# EAGLE design pidshield-mk-3.1 (EAGLE 6.5.0)
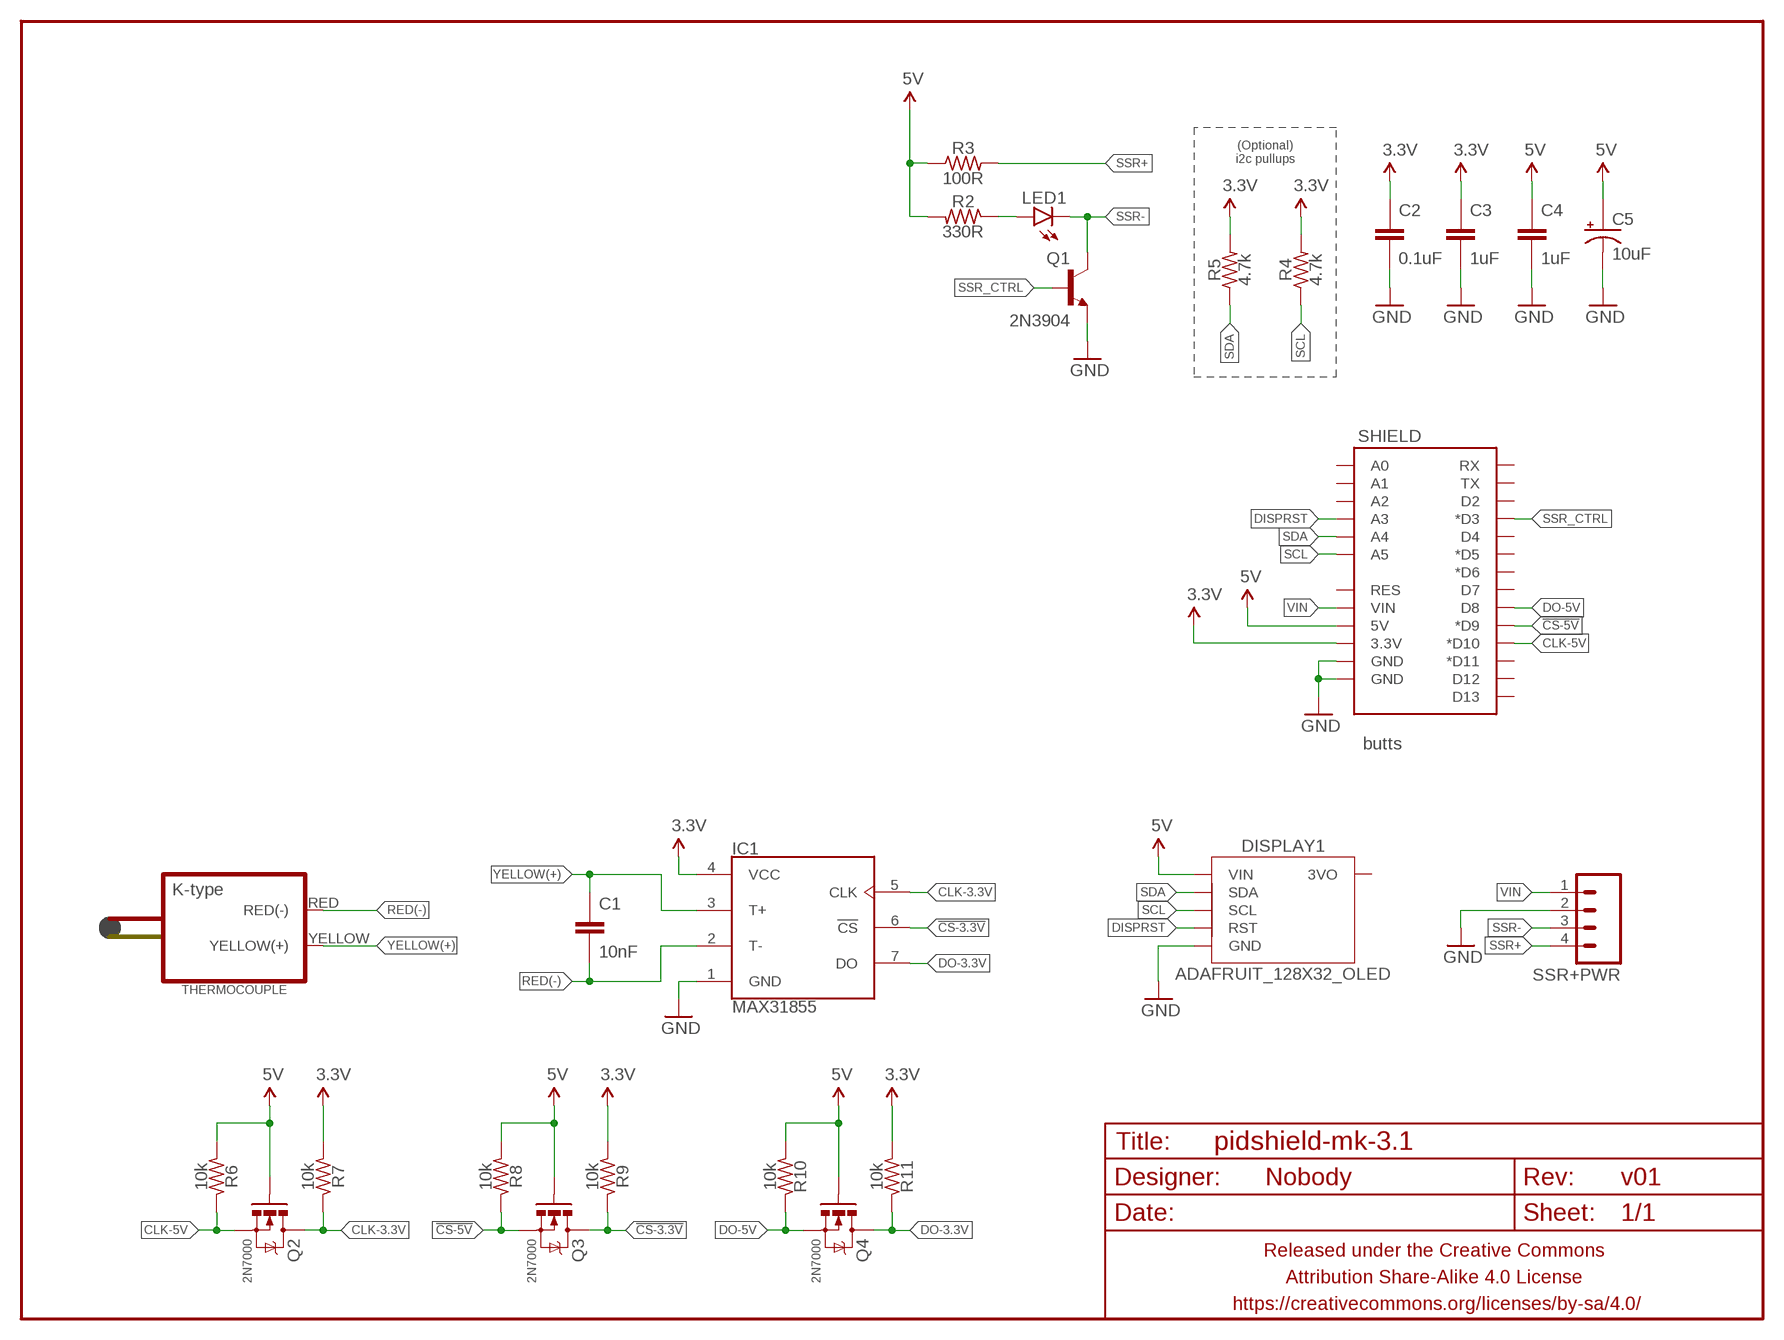
[diagram p0: schematic, sheet 1]

## Parts
C1  10nF  CAPACITOR-CERAMICC0805  [C0805]
C2  0.1uF  CAPACITOR-CERAMIC025-024X044  [C025-024X044]
C3  1uF  CAPACITOR-CERAMIC025-024X044  [C025-024X044]
C4  1uF  CAPACITOR-CERAMIC025-024X044  [C025-024X044]
C5  10uF  CAPACITOR-POLARIZEDE2.5-6  [E2,5-6]
DISPLAY1  ADAFRUIT_128X32_OLED  ADAFRUIT_128X32_OLED_I2CNOTITLE  [ADAFRUIT_128X32_OLED_I2C_CLOSER_NOTITLE]
FRAME1  FRAME-LETTERNO_PACKAGE  [DUMMY]
IC1  MAX31855  MAX31855SOIC  [SOIC127P600X175-8N]
LED1  LED3MM-LESS  [LED3MM-LESSSILK]
Q1  2N3904  TRANSISTOR_NPNTO-92-AMMO-EBC  [TO-92-AMMO]
Q2  2N7000  MOSFET-NCHANNEL2N7000-AMMO  [TO-92-AMMO]
Q3  2N7000  MOSFET-NCHANNEL2N7000-AMMO  [TO-92-AMMO]
Q4  2N7000  MOSFET-NCHANNEL2N7000-AMMO  [TO-92-AMMO]
R2  330R  RESISTORPTH-AXIAL-7.62MM  [RESISTOR-AXIAL-PTH-7.62MM]
R3  100R  RESISTORPTH-AXIAL-7.62MM  [RESISTOR-AXIAL-PTH-7.62MM]
R4  4.7k  RESISTORPTH-AXIAL-7.62MM  [RESISTOR-AXIAL-PTH-7.62MM]
R5  4.7k  RESISTORPTH-AXIAL-7.62MM  [RESISTOR-AXIAL-PTH-7.62MM]
R6  10k  RESISTORPTH-AXIAL-7.62MM  [RESISTOR-AXIAL-PTH-7.62MM]
R7  10k  RESISTORPTH-AXIAL-7.62MM  [RESISTOR-AXIAL-PTH-7.62MM]
R8  10k  RESISTORPTH-AXIAL-7.62MM  [RESISTOR-AXIAL-PTH-7.62MM]
R9  10k  RESISTORPTH-AXIAL-7.62MM  [RESISTOR-AXIAL-PTH-7.62MM]
R10  10k  RESISTORPTH-AXIAL-7.62MM  [RESISTOR-AXIAL-PTH-7.62MM]
R11  10k  RESISTORPTH-AXIAL-7.62MM  [RESISTOR-AXIAL-PTH-7.62MM]
SHIELD  butts  ARDUINO_SHIELD_SMALLERNEKKID  [ARDUINO_SHIELD_SMALLER_NEKKID]
SSR+PWR  M04JST_XH_RA  [JST-4-XH-RA-PTH]
THERMOCOUPLE  THERMOCOUPLE-CONNECTORMINI-PCB  [PCC-SMP]

## Nets
3.3V: C2.1 C3.1 IC1.4(VCC) R4.P$2 R5.P$2 R7.P$2 R9.P$2 R11.P$2 SHIELD.3.3V
5V: C4.1 C5.+ DISPLAY1.VIN Q2.2(G) Q3.2(G) Q4.2(G) R2.P$2 R3.P$1 R6.P$2 R8.P$2 R10.P$2 SHIELD.5V
!CS-3.3V: IC1.6(!CS) Q3.3(D) R9.P$1
!CS-5V: Q3.1(S) R8.P$1 SHIELD.D9(*D9)
CLK-3.3V: IC1.5(CLK) Q2.3(D) R7.P$1
CLK-5V: Q2.1(S) R6.P$1 SHIELD.D10(*D10)
DISPRST: DISPLAY1.RST SHIELD.A3
DO-3.3V: IC1.7(DO) Q4.3(D) R11.P$1
DO-5V: Q4.1(S) R10.P$1 SHIELD.D8
GND: C2.2 C3.2 C4.2 C5.- DISPLAY1.GND IC1.1(GND) Q1.1(E) SHIELD.GND@0(GND) SHIELD.GND@1(GND) SSR+PWR.2
N$2: LED1.A R2.P$1
RED(-): C1.2 IC1.2(T-) THERMOCOUPLE.RED(RED(-))
SCL: DISPLAY1.SCL R4.P$1 SHIELD.A5
SDA: DISPLAY1.SDA R5.P$1 SHIELD.A4
SSR+: R3.P$2 SSR+PWR.4
SSR-: LED1.K(C) Q1.3(C) SSR+PWR.3
SSR_CTRL: Q1.2(B) SHIELD.D3(*D3)
VIN: SHIELD.VIN SSR+PWR.1
YELLOW(+): C1.1 IC1.3(T+) THERMOCOUPLE.YELLOW(YELLOW(+))
Unconnected: DISPLAY1.3VO SHIELD.A0 SHIELD.A1 SHIELD.A2 SHIELD.D2 SHIELD.D4 SHIELD.D5(*D5) SHIELD.D6(*D6) SHIELD.D7 SHIELD.D11(*D11) SHIELD.D12 SHIELD.D13 SHIELD.RES SHIELD.RX SHIELD.TX

## Notes on the sheet
- (Optional)
  i2c pullups

## Library data of the parts
C1-C4 = A_butts:CAPACITOR-CERAMIC: CAPACITOR, European symbol
C5 = A_butts:CAPACITOR-POLARIZED: POLARIZED CAPACITOR, American symbol
DISPLAY1 = A_butts:ADAFRUIT_128X32_OLED_I2C
FRAME1 = A_butts:FRAME-LETTER: Schematic Frame Standard 8.5x11 US Letter frame; DESIGNER: Nobody; VERSION: v01
IC1 = A_butts:MAX31855
LED1 = A_butts:LED: LEDs Standard schematic elements and footprints for 5mm, 3mm, 1206, and 0603 sized LEDs. 5mm - Spark Fun Electronics SKU : COM-00529 (and others)
Q1 = A_butts:TRANSISTOR_NPN: Generic NPN BJT MMBT2222A - TRANS-08049 (SOT-23, 1A 40V) MPSA42 - TRANS-09116 (SOT-23, 500mA 300V) MMBT5088LT1G - TRANS-11160 (SOT-23, 50 mA 30V) BC547 - COM-08928 <http://www.sparkfun.com/products/8928> (TO-92 45V 100mA) (1.Collector 2.Base 3.Emitter) 2N3904 - COM-00521 <http://www.sparkfun.com/products/521> (TO-92 40V 200mA) (1.Emitter 2.Base 3.Collector) P2N2222A - COM-12852 <http://www.sparkfun.com/products/12852> (TO-92 40V 600mA) (1.Collector 2.Base 3.Emitter)
Q2-Q4 = A_butts:MOSFET-NCHANNEL: Common NMOSFET Parts MFG P/N Store ID Prod ID FDD8780 TRANS-09984 SI7820DN TRANS-11055 FDS6630A IC-08089 2N7002PW TRANS-11151 FQP30N06L COM-10213 TRANS-10060 BSS123LT1G TRANS-08345 BSS138 TRANS-00830 BS170 2N7000
R2-R11 = A_butts:RESISTOR: RESISTOR, American symbol
SHIELD = A_butts:ARDUINO_SHIELD_SMALLER
SSR+PWR = A_butts:M04: Header 4 Standard 4-pin 0.1" header. Use with straight break away headers (SKU : PRT-00116), right angle break away headers (PRT-00553), swiss pins (PRT-00743), machine pins (PRT-00117), and female headers (PRT-00115). Molex polarized connector foot print use with SKU : PRT-08231 with associated crimp pins and housings. 1MM SMD Version SKU: PRT-10208
THERMOCOUPLE = A_butts:THERMOCOUPLE-CONNECTOR

## Board
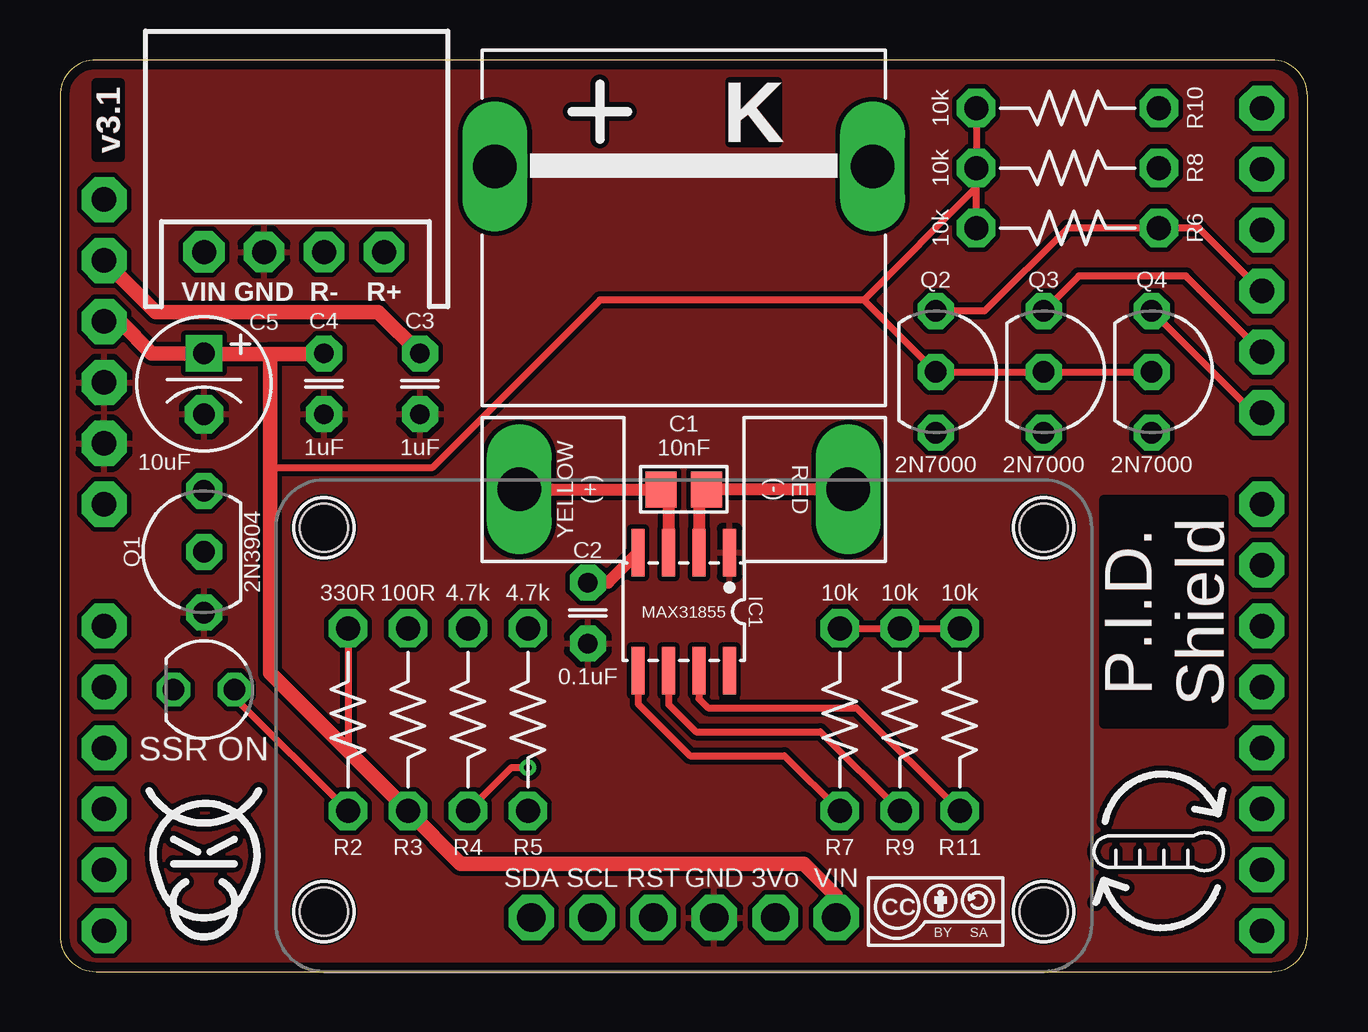
[diagram p1: board, top side]
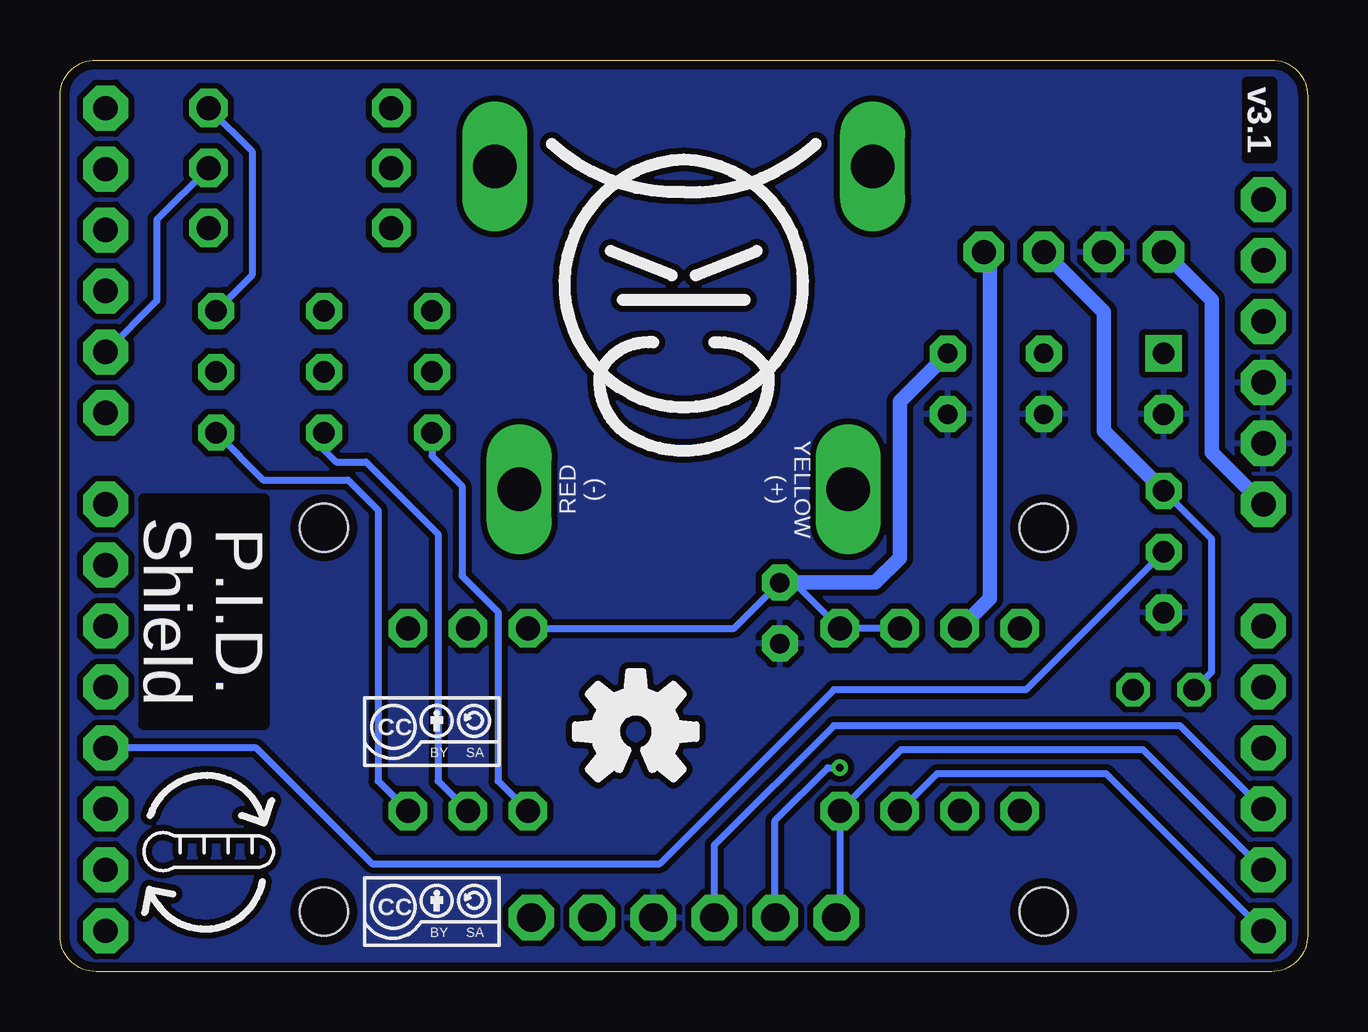
[diagram p2: board, bottom side, seen from below]

Size 52 x 38 mm. Coordinates in mm from the lower left corner, seen from the top.
Outline: 50.5,38 1.5,38 arc90 0,36.5 0,1.5 arc90 1.5,0 50.5,0 arc90 52,1.5 52,36.5 arc90 50.5,38
Copper layers (1*16): Top 0.0356mm / dielectric 1.5011mm / Bottom 0.0356mm
Design rules "LaenPCBOrder2": minimum track width 6mil, minimum drill 13mil, track to track 6mil, track to pad 6mil, pad to pad 6mil, via to via 6mil, smd to smd 6mil, copper to edge 15mil, drill to drill 6mil, minimum pad ring 7mil, minimum via ring 7mil, stop-mask expansion 3mil, vias tented up to drill 20mil, thermal gap 10mil

### Footprints (pad centres in the part's own frame; a part is rotated, then mirrored left to right if it is on the bottom)
C0805 = smd 1.3 x 1.5: 1 -0.95,0; 2 0.95,0
C025-024X044 = drill 0.813 pad 1.5 octagon: 1 -1.27,0; 2 1.27,0
E2,5-6 = drill 0.9 pad 1.524 square: + -1.27,0 | drill 0.9 pad 1.6 octagon: - 1.27,0
ADAFRUIT_128X32_OLED_I2C_CLOSER_NOTITLE = drill 1.2 pad 1.9 octagon: 3VO 3.81,0; GND 1.27,0; RST -1.27,0; SCL -3.81,0; SDA -6.35,0; VIN 6.35,0 | hole 2: -15,16.246; 15,16.246; -15,0.246; 15,0.246
SOIC127P600X175-8N = smd 1.981 x 0.559: 1 -2.464,1.905; 2 -2.464,0.635; 3 -2.464,-0.635; 4 -2.464,-1.905; 5 2.464,-1.905; 6 2.464,-0.635; 7 2.464,0.635; 8 2.464,1.905
LED3MM-LESSSILK = drill 0.9 pad 1.4 octagon: A -1.27,0; K 1.27,0
TO-92-AMMO = drill 0.9 pad 1.5 octagon: 1 -2.54,0; 2 0,0; 3 2.54,0
RESISTOR-AXIAL-PTH-7.62MM = drill 1 pad 1.6 octagon: P$1 -3.81,0; P$2 3.81,0
ARDUINO_SHIELD_SMALLER_NEKKID = drill 1.016 pad 1.88 octagon: 3.3V 48.26,-27.94; 5V 48.26,-25.4; A0 48.26,-12.7; A1 48.26,-10.16; A2 48.26,-7.62; A3 48.26,-5.08; A4 48.26,-2.54; A5 48.26,0; D2 0,-5.08; D3 0,-7.62; D4 0,-10.16; D5 0,-12.7; D6 0,-15.24; D7 0,-17.78; D8 0,-21.59; D9 0,-24.13; D10 0,-26.67; D11 0,-29.21; D12 0,-31.75; D13 0,-34.29; GND@0 48.26,-22.86; GND@1 48.26,-20.32; RES 48.26,-30.48; RX 0,0; TX 0,-2.54; VIN 48.26,-17.78
JST-4-XH-RA-PTH = drill 1 pad 1.74 octagon: 1 0,0 | drill 1 pad 1.7 octagon: 2 2.5,0; 3 5,0; 4 7.5,0
PCC-SMP = drill 1.8 long: P$1 13.462,-7.874; P$2 13.462,7.874; RED 0,-6.858; YELLOW 0,6.858

### Placement (x,y rotation side)
C1  26,20.1 0 top
C2  22,14.94 270 top
C3  15,24.5 270 top
C4  11,24.5 270 top
C5  6,24.5 270 top
DISPLAY1  26,2.25 0 top
FRAME1  0,0 0 top
IC1  26,15 270 top
LED1  6,11.75 180 top
Q1  6,17.5 90 top
Q2  36.5,25 270 top
Q3  41,25 270 top
Q4  45.5,25 270 top
R2  12,10.5 90 top
R3  14.5,10.5 90 top
R4  17,10.5 90 top
R5  19.5,10.5 90 top
R6  42,31 180 top
R7  32.5,10.5 90 top
R8  42,33.5 180 top
R9  35,10.5 90 top
R10  42,36 180 top
R11  37.5,10.5 90 top
SHIELD  50.1,1.7 180 top
SSR+PWR  6,30 0 top
THERMOCOUPLE  26,20.1 90 top
U$1  [COW_METAL]  26,27.5 0 bottom
U$2  [CC-BY-SA-4.0-NO-URL]  36.5,2.5 0 bottom
U$3  [FEEDBACK3]  46,5 90 top
U$4  [CC-BY-SA-4.0-NO-URL]  36.5,2.5 0 top
U$5  [CC-BY-SA-4.0-NO-URL]  36.5,10 0 bottom
U$6  [FEEDBACK3]  46,5 270 bottom
U$7  [OSHWLOGO_BOT_0.2_A]  28,10 0 top
U$8  [COW_SMALL_METAL_NOTEXT]  6,5 0 top

### Tracks (layer width: path | path; a pad name or v marks a point on that pad's centre or on a via)
3.3V
  Top 0.3: R7.P$2 R9.P$2 R11.P$2
  Top 0.5: IC1.4 22.84,16.21 C2.1
  Top 0.6: SHIELD.3.3V 3.98,27.5 13.27,27.5 C3.1
  Bottom 0.3: R7.P$2 23.9,14.31 C2.1 21.4,16.21 R5.P$2 R4.P$2
  Bottom 0.6: C3.1 17,23.77 17,17.25 18.04,16.21 C2.1
5V
  Top 0.3: 33.5,28 Q2.2 Q3.2 Q4.2 | R10.P$2 R8.P$2 | 33.5,28 22.5,28 15.5,21 8.75,21 | R2.P$2 12,9.19 R3.P$1 | 33.5,28 38.19,32.69 R8.P$2 | R6.P$2 R8.P$2
  Top 0.6: SHIELD.5V 2.5,27.1 3.83,25.77 C5.+ 6.02,25.75 8.75,25.75 | 8.75,25.75 8.75,21 8.75,12.44 R3.P$1 16.69,4.5 31,4.5 32.35,3.15 DISPLAY1.VIN | C4.1 10.98,25.75 8.75,25.75
!CS-3.3V
  Top 0.3: IC1.6 25.36,11.13 26.5,10 31.69,10 R9.P$1
  Bottom 0.3: Q3.3 41,21.75 40.5,21.25 39.25,21.25 36.25,18.25 36.25,7.94 R9.P$1
!CS-5V
  Top 0.3: SHIELD.D9 46.93,29 42.46,29 Q3.1
  Bottom 0.3: R8.P$1 47.97,31.34 47.97,27.96 SHIELD.D9
CLK-3.3V
  Top 0.3: IC1.5 24.09,11.15 26.25,9 30.19,9 R7.P$1
  Bottom 0.3: Q2.3 36.5,21.5 35.25,20.25 35.25,16.5 33.75,15 33.75,7.94 R7.P$1
CLK-5V
  Top 0.3: SHIELD.D10 47.47,31 R6.P$1 42,31 38.54,27.54 Q2.1
DISPRST
  Bottom 0.3: SHIELD.A3 5.31,10.25 19.75,10.25 24.73,5.27 DISPLAY1.RST
DO-3.3V
  Top 0.3: IC1.7 26.64,11.37 27,11 33.19,11 R11.P$1
  Bottom 0.3: Q4.3 43.54,20.5 40,20.5 38.75,19.25 38.75,7.94 R11.P$1
DO-5V
  Top 0.3: Q4.1 49.75,23.29 SHIELD.D8
  Bottom 0.3: R10.P$1 44,34.19 44,29.04 Q4.1
GND
  pour Top (isolate 0.2): 50.6,-0.1 1.4,-0.1 arc-90 -0.1,1.4 -0.1,36.6 arc-90 1.4,38.1 50.6,38.1 arc-90 52.1,36.6 52.1,1.4 arc-90
  pour Bottom (isolate 0.25): 50.6,-0.1 1.4,-0.1 arc-90 -0.1,1.4 -0.1,36.6 arc-90 1.4,38.1 50.6,38.1 arc-90 52.1,36.6 52.1,1.4 arc-90
N$2
  Top 0.3: LED1.A 7.27,11.42 R2.P$1
RED(-)
  Top 0.3: C1.2 26.64,19.79
  Top 0.5: THERMOCOUPLE.RED C1.2 | 26.64,19.79 IC1.2
SCL  (via drill 0.33)
  Top 0.3: v19.5,8.5 18.81,8.5 R4.P$1
  Bottom 0.3: SHIELD.A5 8.39,8.25 15.44,8.25 R4.P$1 | DISPLAY1.SCL 22.19,6.31 20,8.5 v19.5,8.5
SDA
  Bottom 0.3: SHIELD.A4 6.85,9.25 16.94,9.25 R5.P$1 19.5,2.4 DISPLAY1.SDA
SSR+
  Bottom 0.6: SSR+PWR.4 13.25,29.75 13.25,15.56 R3.P$2
SSR-
  Bottom 0.3: LED1.K 4,12.48 4,18.04 Q1.3
  Bottom 0.6: SSR+PWR.3 8.5,27.5 8.5,22.54 Q1.3
SSR_CTRL
  Bottom 0.3: Q1.2 11.75,11.75 19.75,11.75 27,4.5 39,4.5 43.82,9.32 SHIELD.D3
VIN
  Bottom 0.6: SSR+PWR.1 4,28 4,21.64 SHIELD.VIN
YELLOW(+)
  Top 0.3: C1.1 25.36,19.79
  Top 0.5: THERMOCOUPLE.YELLOW C1.1 | 25.36,19.79 IC1.3

### Text on the board
Top: P.I.D. / Shield
Bottom: P.I.D. / Shield
tPlace: VIN | GND | R- | R+ | P.I.D. / Shield | SSR ON
bPlace: P.I.D. / Shield